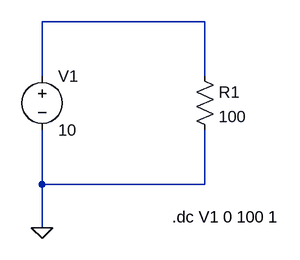
[diagram p0: schematic Draft6.asc]
Draft6.asc, the LTspice schematic file:
Version 4
SHEET 1 880 680
WIRE 368 48 128 48
WIRE 128 128 128 48
WIRE 368 128 368 48
WIRE 128 288 128 208
WIRE 368 288 368 208
WIRE 368 288 128 288
WIRE 128 352 128 288
FLAG 128 352 0
SYMBOL voltage 128 112 R0
SYMATTR InstName V1
SYMATTR Value 10
SYMBOL res 352 112 R0
SYMATTR InstName R1
SYMATTR Value 100
TEXT 320 336 Left 2 !.dc V1 0 100 1

The netlist it stands for:
* Draft6.asc
V1 N001 0 10
R1 N001 0 100
.dc V1 0 100 1
.backanno
.end